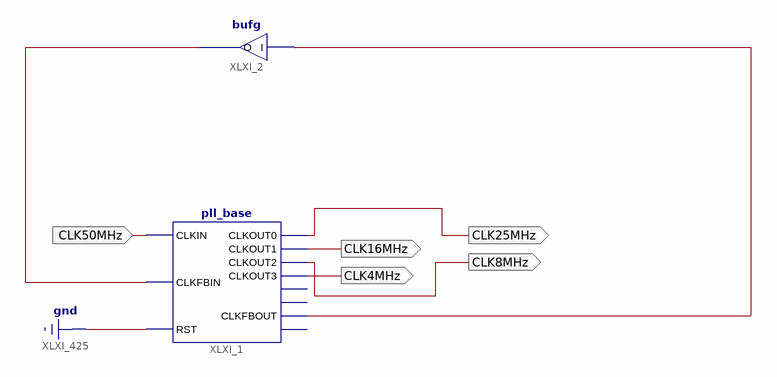
[diagram p0: schematic sheet 1]
// Xilinx ISE schematic ZXUNO_CLOCKS.sch (spartan6) as structural Verilog: 2 symbols, 5 ports
module ZXUNO_CLOCKS (
  input  CLK50MHz,
  output CLK25MHz,
  output CLK4MHz,
  output CLK8MHz,
  output CLK16MHz
);

  wire XLXN_2, XLXN_3;

  pll_base #(.CLKOUT4_DIVIDE(1), .CLKOUT3_DIVIDE(96), .CLKOUT2_DIVIDE(48), .CLKOUT1_DIVIDE(24), .CLKOUT0_DIVIDE(16), .CLKFBOUT_MULT(8)) XLXI_1 (
    .CLKIN(CLK50MHz), .CLKFBIN(XLXN_3), .RST(1'b0), .CLKOUT0(CLK25MHz), .CLKOUT1(CLK16MHz),
    .CLKOUT2(CLK8MHz), .CLKOUT3(CLK4MHz), .CLKFBOUT(XLXN_2));  // open: CLKOUT4, CLKOUT5, LOCKED
  bufg XLXI_2 (.I(XLXN_2), .O(XLXN_3));
endmodule
